# EAGLE design MicroLipoV1.0 (EAGLE 7.6.0)
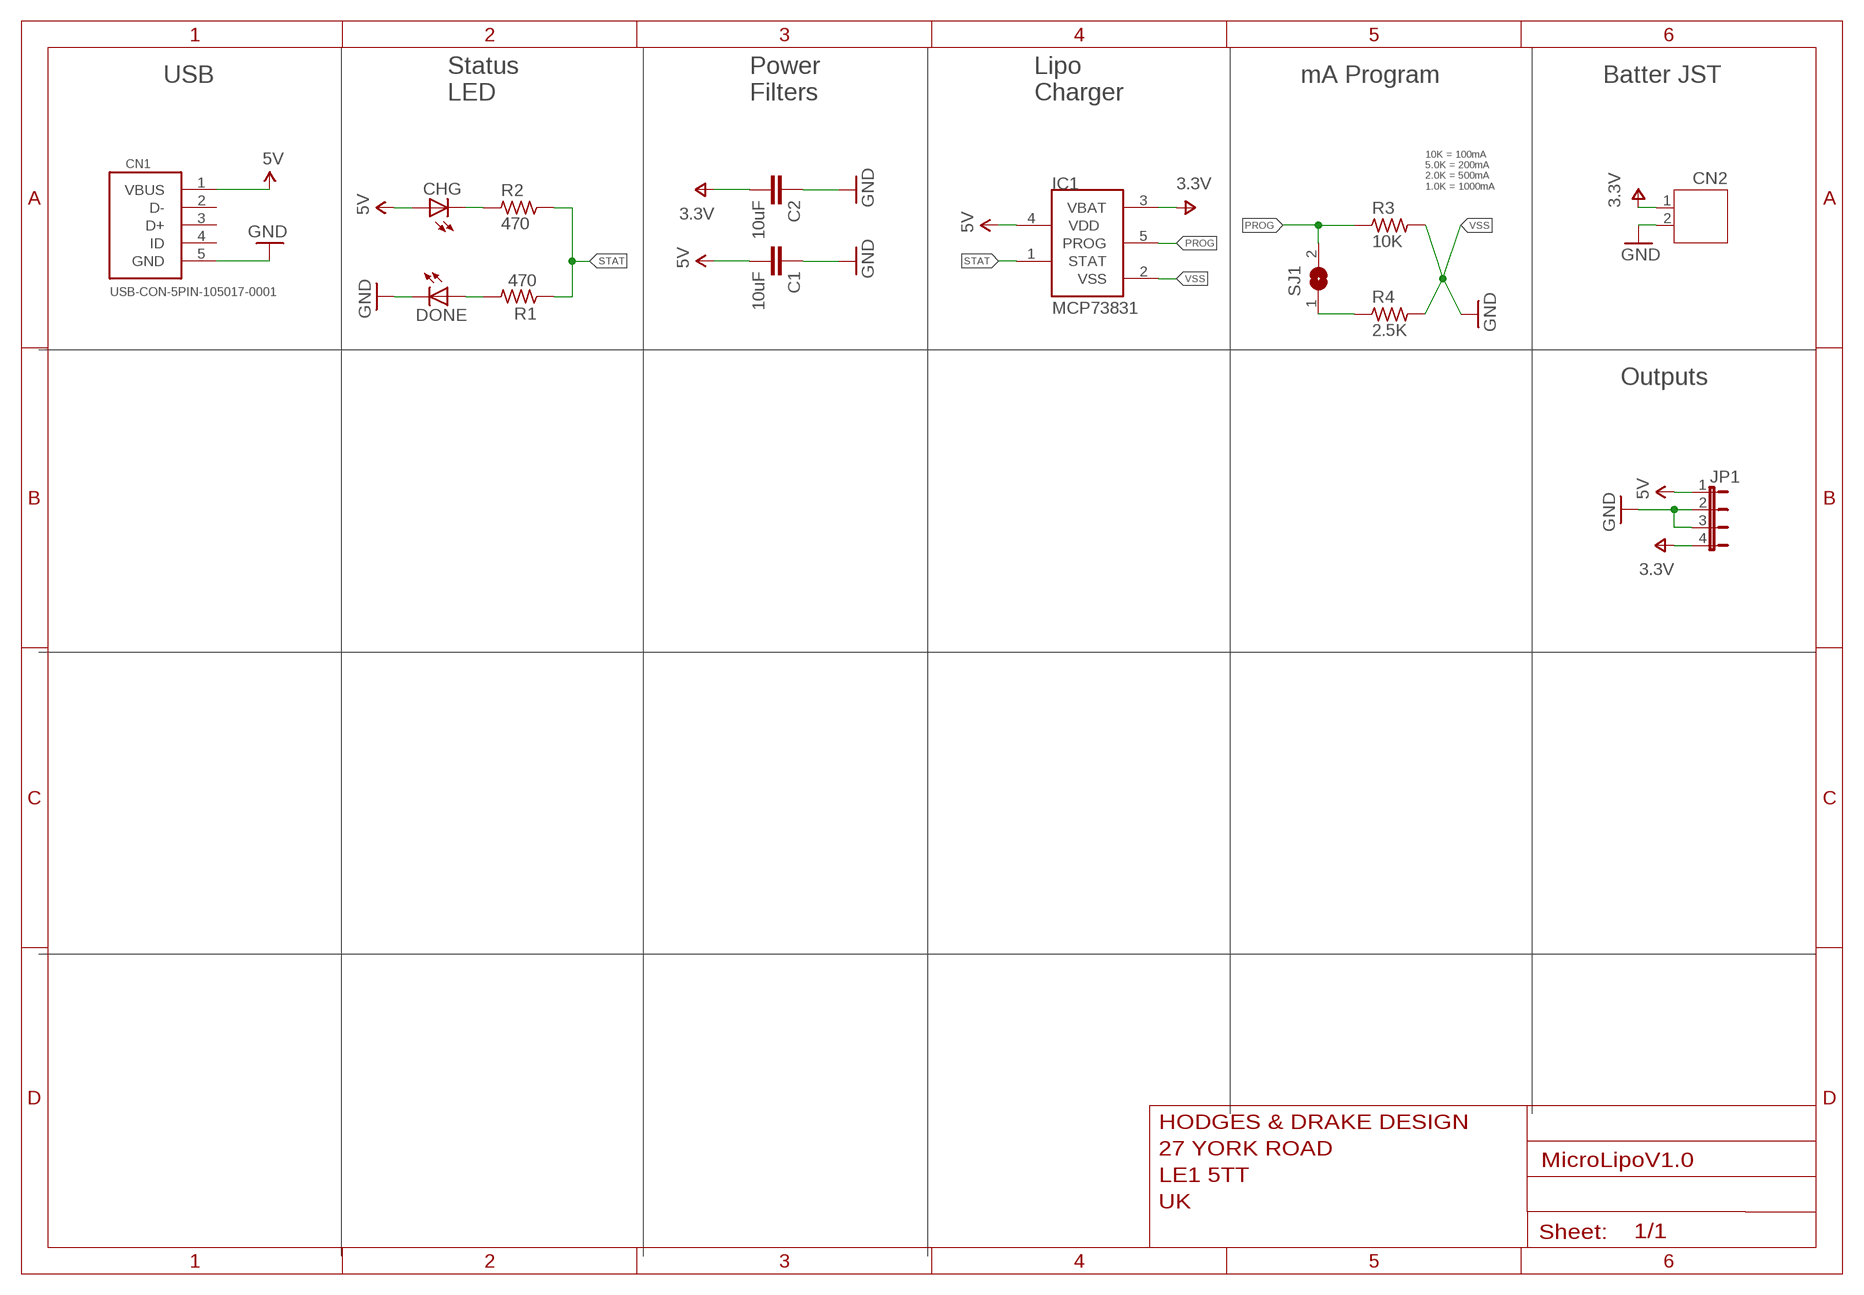
[diagram p0: schematic, sheet 1]

## Parts
C1  10uF  C-EUC0805K  [C0805K]
C2  10uF  C-EUC0805K  [C0805K]
CHG  LEDCHIPLED_0805  [CHIPLED_0805]
CN1  USB-CON-5PIN-105017-0001  [USB-MICRO-MOLEX-105017-0001]
CN2  JST-PH2  [JST-PH2-S2B]
DONE  LEDCHIPLED_0805  [CHIPLED_0805]
IC1  MCP73831  [SOT23-5L]
JP1  JP4E  [JP4]
R1  470  R_0805  [R0805]
R2  470  R_0805  [R0805]
R3  10K  R_0805  [R0805]
R4  2.5K  R_0805  [R0805]
SJ1  SJ  [SJ]

## Nets
5V: C1.2 CHG.A CN1.1(VBUS) IC1.4(VDD) JP1.1
GND: C1.1 C2.1 CN1.5(GND) CN2.2 DONE.C JP1.2 JP1.3
N$1: CHG.C R2.1
N$2: DONE.A R1.2
N$3: R4.1 SJ1.1
PROG: IC1.5(PROG) R3.1 SJ1.2
STAT: IC1.1(STAT) R1.1 R2.2
V+: C2.2 CN2.1 IC1.3(VBAT) JP1.4 ; supply symbol labelled 3.3V
VSS: IC1.2(VSS) R3.2 R4.2 ; supply symbol labelled GND
Unconnected: CN1.2(D-) CN1.3(D+) CN1.4(ID)

## Notes on the sheet
- USB | mA Program | Batter JST
- Status
  LED
- Power
  Filters
- Lipo
  Charger
- 10K = 100mA
  5.0K = 200mA
  2.0K = 500mA
  1.0K = 1000mA
- Outputs

## Library data of the parts
C1 C2 = rcl:C-EU: CAPACITOR, European symbol
CHG DONE = adafruit:LED: LED OSRAM: - CHIPLED LG R971, LG N971, LY N971, LG Q971, LY Q971, LO R971, LY R971 LH N974, LH R974 LS Q976, LO Q976, LY Q976 LO Q996 - Hyper CHIPLED LW Q18S LB Q993, LB Q99A, LB R99A - SideLED LS A670, LO A670, LY A670, LG A670, LP A670 LB A673, LV A673, LT A673, LW A673 LH A674 LY A675 LS A676, LA A676, LO A676, LY A676, LW A676 LS A679, LY A679, LG A679 - Hyper Micro SIDELED® LS Y876, LA Y876, LO Y876, LY Y876 LT Y87S - SmartLED LW L88C, LW L88S LB L89C, LB L89S, LG L890 LS L89K, LO L89K, LY L89K LS L896, LA L896, LO L896, LY L896 - TOPLED LS T670, LO T670, LY T670, LG T670, LP T670 LSG T670, LSP T670, LSY T670, LOP T670, LYG T670 LG T671, LOG T671, LSG T671 LB T673, LV T673, LT T673, LW T673 LH T674 LS T676, LA T676, LO T676, LY T676, LB T676, LH T676, LSB T676, LW T676 LB T67C, LV T67C, LT T67C, LS T67K, LO T67K, LY T67K, LW E67C LS E67B, LA E67B, LO E67B, LY E67B, LB E67C, LV E67C, LT E67C LW T67C LS T679, LY T679, LG T679 LS T770, LO T770, LY T770, LG T770, LP T770 LB T773, LV T773, LT T773, LW T773 LH T774 LS E675, LA E675, LY E675, LS T675 LS T776, LA T776, LO T776, LY T776, LB T776 LHGB T686 LT T68C, LB T68C - Hyper Mini TOPLED® LB M676 - Mini TOPLED Santana® LG M470 LS M47K, LO M47K, LY M47K Source: http://www.osram.convergy.de/
CN1 = GeekAmmo:USB-CON-5PIN: Molex Micro USB 105017-0001
CN2 = con-jst-ph:JST-PH2
IC1 = microchip-update-2:MCP73831: Miniature Single-Cell, Fully Integrated Li-Ion, Li-Polymer Charge Management Controllers
JP1 = jumper:JP4E: JUMPER
R1-R4 = rc-master-smd:R_: RESISTOR
SJ1 = jumper:SJ: SMD solder JUMPER

## Board
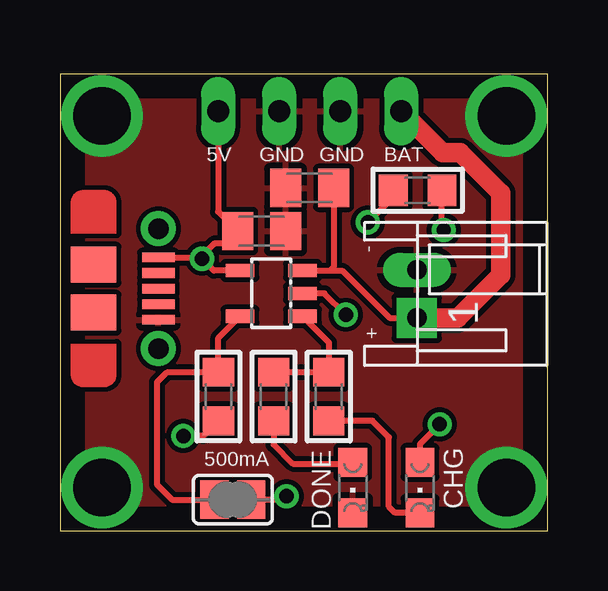
[diagram p1: board, top side]
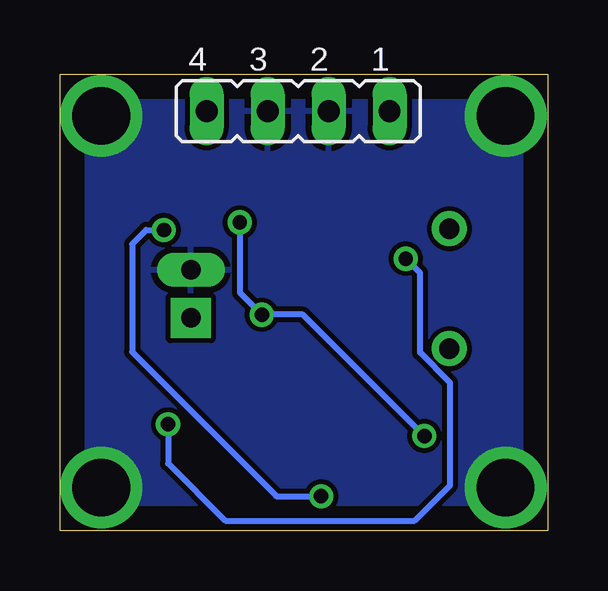
[diagram p2: board, bottom side, seen from below]

Size 20.32 x 19.05 mm. Coordinates in mm from the lower left corner, seen from the top.
Outline: 0,0 20.32,0 20.32,19.05 0,19.05 0,0
Copper layers (1*16): Top 0.035mm / dielectric 1.5mm / Bottom 0.035mm
Design rules "default": minimum track width 10mil, minimum drill 24mil, track to track 8mil, track to pad 8mil, pad to pad 8mil, via to via 8mil, smd to smd 8mil, copper to edge 40mil, drill to drill 8mil, minimum pad ring 10mil, minimum via ring 8mil, stop-mask expansion 4mil, vias tented up to drill 0mil, thermal gap 10mil

### Footprints (pad centres in the part's own frame; a part is rotated, then mirrored left to right if it is on the bottom)
C0805K = smd 1.3 x 1.6: 1 -1,0; 2 1,0
CHIPLED_0805 = smd 1.2 x 1.2: A 0,-1.05; C 0,1.05
USB-MICRO-MOLEX-105017-0001 = smd 0.4 x 1.35: 1 1.2,0; 2 1.85,0; 3 2.5,0; 4 3.15,0; 5 3.8,0 | drill 0.85 pad 1.45: P$1 0,0; P$2 5,0 | smd 1.5 x 1.9: P$3 3.5,-2.7; P$4 1.5,-2.7
JST-PH2-S2B = drill 0.813 pad 1.676 square: 1 -1.977,2.169 | drill 0.813 pad 1.422 long: 2 -3.977,2.169
SOT23-5L = smd 0.55 x 1.2: 1 -0.95,-1.3; 2 0,-1.3; 3 0.95,-1.3; 4 0.95,1.3; 5 -0.95,1.3
JP4 = drill 0.914 long: 1 -3.81,0; 2 -1.27,0; 3 1.27,0; 4 3.81,0
R0805 = smd 1.2 x 1.3: 1 -1.016,0; 2 1.016,0
SJ = smd 1.168 x 1.6: 1 -0.762,0; 2 0.762,0

### Placement (x,y rotation side)
C1  8.4,12.5 180 top
C2  10.4,14.3 0 top
CHG  15,1.8 180 top
CN1  4.1,12.6 270 top
CN2  12.7,6.9 270 top
DONE  12.2,1.8 180 top
IC1  8.8,9.9 90 top
JP1  10.4,17.5 180 bottom
R1  8.9,5.6 270 top
R2  11.2,5.6 90 top
R3  6.6,5.6 270 top
R4  14.9,14.2 180 top
SJ1  7.2,1.3 180 top

### Tracks (layer width: path | path; a pad name or v marks a point on that pad's centre or on a via)
5V  (via drill 0.6)
  Top 0.254: JP1.1 6.59,13.31 C1.2 arc-90 6.89,11.99 6.45,11.99 5.92,11.46 | CN1.1 5.86,11.4 | IC1.4 6.41,10.85 v5.92,11.35 | v5.92,11.35 5.86,11.4 | 5.86,11.4 5.92,11.46 | CHG.A 15,3.62 v15.82,4.44 | v5.92,11.35 5.92,11.46
  Bottom 0.254: v15.82,4.44 15.82,2.81 13.43,0.42 5.54,0.42 4.06,1.9 4.06,6.17 5.32,7.43 5.32,10.75 v5.92,11.35
GND  (via drill 2.4)
  other vias: 1.75,1.8 18.6,1.8 18.6,17.3 1.75,17.3
  pour Bottom: -0.9,20.2 -1.1,-1.3 21.6,-1.3 21.6,20.5
  pour Top: -0.9,20.2 -1.1,-1.3 21.6,-1.3 21.6,20.5
N$1
  Top 0.254: CHG.C 13.95,0.75 13.7,1 13.7,3.9 13.02,4.58 R2.1
N$2
  Top 0.254: R1.2 8.9,3.6 9.7,2.8 12.15,2.8 DONE.A
N$3  (via drill 0.6)
  Top 0.254: v9.44,1.44 9.56,1.3 SJ1.1 | v15.99,12.54 15.92,12.61 R4.1
  Bottom 0.254: v9.44,1.44 11.32,1.44 11.32,1.46 17.32,7.46 17.32,11.95 16.73,12.54 v15.99,12.54
PROG
  Top 0.254: IC1.5 6.6,8.05 R3.1 6.58,6.6 4.45,6.6 4.04,6.19 4.04,1.93 4.67,1.3 SJ1.2
STAT
  Top 0.254: IC1.1 11.2,7.85 R2.2 R1.1
V+
  Top 0.254: IC1.3 11.26,10.85 | 11.26,10.85 11.76,10.85 13.73,8.88 CN2.1 | C2.2 11.4,10.99 11.26,10.85
  Top 0.813: JP1.4 15.94,15.77 16.67,15.77 18.36,14.08 18.36,10.67 16.57,8.88 CN2.1
VSS  (via drill 0.6)
  Top 0.254: R4.2 13.88,13.91 v12.83,12.86 | v11.91,9.01 11.02,9.9 IC1.2 | R3.2 5.97,3.95 v5.14,3.95
  Bottom 0.254: v12.83,12.86 12.83,9.93 v11.91,9.01 10.2,9.01 v5.14,3.95

### Text on the board
tPlace: 5V | GND | GND | BAT | - | + | 500mA